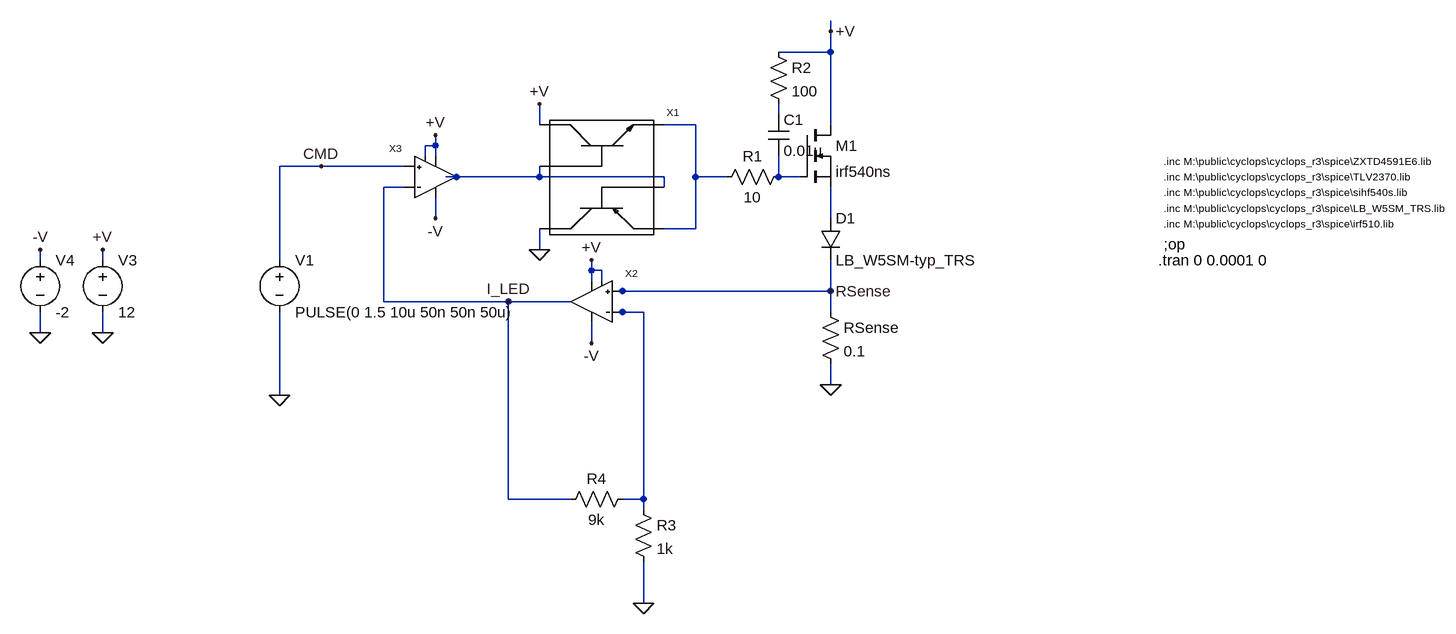
[diagram p0: schematic cyclops_r3.2.asc]
cyclops_r3.2.asc, the LTspice schematic file:
Version 4
SHEET 1 1460 852
WIRE 160 -48 160 -64
WIRE 160 -16 160 -48
WIRE 160 -16 80 -16
WIRE 80 80 80 64
WIRE -288 96 -288 64
WIRE -48 96 -96 96
WIRE 160 96 160 -16
WIRE -448 128 -448 112
WIRE -448 128 -464 128
WIRE -464 144 -464 128
WIRE -448 144 -448 128
WIRE -624 160 -688 160
WIRE -496 160 -624 160
WIRE -416 176 -432 176
WIRE -288 176 -288 160
WIRE -288 176 -416 176
WIRE -96 176 -288 176
WIRE -48 176 -48 96
WIRE 0 176 -48 176
WIRE 80 176 80 144
WIRE 112 176 80 176
WIRE -496 192 -528 192
WIRE -96 192 -96 176
WIRE -448 240 -448 208
WIRE 160 240 160 192
WIRE -48 256 -48 176
WIRE -48 256 -96 256
WIRE -288 288 -288 256
WIRE -1056 304 -1056 288
WIRE -960 304 -960 288
WIRE -688 304 -688 160
WIRE -208 320 -208 304
WIRE -192 320 -208 320
WIRE -208 336 -208 320
WIRE -192 336 -192 320
WIRE -160 352 -176 352
WIRE 160 352 160 304
WIRE 160 352 -160 352
WIRE -528 368 -528 192
WIRE -336 368 -528 368
WIRE -240 368 -336 368
WIRE -160 384 -176 384
WIRE -128 384 -160 384
WIRE 160 384 160 352
WIRE -1056 416 -1056 384
WIRE -960 416 -960 384
WIRE -208 432 -208 400
WIRE 160 496 160 464
WIRE -688 512 -688 384
WIRE -336 672 -336 368
WIRE -240 672 -336 672
WIRE -128 672 -128 384
WIRE -128 672 -160 672
WIRE -128 688 -128 672
WIRE -128 832 -128 768
FLAG 160 496 0
FLAG -128 832 0
FLAG -688 512 0
FLAG 160 352 RSense
FLAG -336 368 I_LED
FLAG -624 160 CMD
FLAG -960 416 0
FLAG -960 288 +V
FLAG -1056 416 0
FLAG -1056 288 -V
FLAG 160 -48 +V
FLAG -288 64 +V
FLAG -288 288 0
FLAG -448 240 -V
FLAG -208 432 -V
FLAG -448 112 +V
FLAG -208 304 +V
SYMBOL nmos 112 96 R0
SYMATTR InstName M1
SYMATTR Value irf540ns
SYMATTR Prefix X
SYMBOL res 144 368 R0
SYMATTR InstName RSense
SYMATTR Value 0.1
SYMATTR SpiceLine pwr=1
SYMBOL res -144 672 R0
SYMATTR InstName R3
SYMATTR Value 1k
SYMBOL res -144 656 R90
WINDOW 0 0 56 VBottom 2
WINDOW 3 32 56 VTop 2
SYMATTR InstName R4
SYMATTR Value 9k
SYMBOL voltage -688 288 R0
WINDOW 123 0 0 Left 2
WINDOW 39 0 0 Left 2
SYMATTR InstName V1
SYMATTR Value PULSE(0 1.5 10u 50n 50n 50u)
SYMBOL voltage -960 288 R0
WINDOW 123 0 0 Left 2
WINDOW 39 0 0 Left 2
SYMATTR InstName V3
SYMATTR Value 12
SYMBOL voltage -1056 288 R0
WINDOW 123 0 0 Left 2
WINDOW 39 0 0 Left 2
SYMATTR InstName V4
SYMATTR Value -2
SYMBOL diode 144 240 R0
SYMATTR InstName D1
SYMATTR Value LB_W5SM-typ_TRS
SYMBOL ZXTD45 -192 176 R0
SYMATTR InstName X1
SYMATTR Prefix X
SYMATTR Value ZXTD4591E6
SYMBOL res 96 160 R90
WINDOW 0 0 56 VBottom 2
WINDOW 3 32 56 VTop 2
SYMATTR InstName R1
SYMATTR Value 10
SYMBOL res 64 -32 R0
SYMATTR InstName R2
SYMATTR Value 100
SYMBOL cap 64 80 R0
SYMATTR InstName C1
SYMATTR Value 0.01µ
SYMATTR SpiceLine V=50
SYMBOL TLV2370 -224 368 R0
SYMATTR InstName X2
SYMATTR Prefix X
SYMATTR Value TLV2370
SYMBOL TLV2370 -432 176 M0
SYMATTR InstName X3
SYMATTR Prefix X
SYMATTR Value TLV2370
TEXT 672 200 Left 1 !.inc M:\\public\\cyclops\\cyclops_r3\\spice\\sihf540s.lib
TEXT 672 280 Left 2 !;op
TEXT 672 224 Left 1 !.inc M:\\public\\cyclops\\cyclops_r3\\spice\\LB_W5SM_TRS.lib
TEXT 664 304 Left 2 !.tran 0 0.0001 0
TEXT 672 176 Left 1 !.inc M:\\public\\cyclops\\cyclops_r3\\spice\\TLV2370.lib
TEXT 672 152 Left 1 !.inc M:\\public\\cyclops\\cyclops_r3\\spice\\ZXTD4591E6.lib
TEXT 672 248 Left 1 !.inc M:\\public\\cyclops\\cyclops_r3\\spice\\irf510.lib

The netlist it stands for:
* cyclops_r3.2.asc
XM1 +V N004 N005 irf540ns  ; pins D G S
RSense RSense 0 0.1 pwr=1
R3 N006 0 1k
R4 N006 I_LED 9k
V1 CMD 0 PULSE(0 1.5 10u 50n 50n 50u)
V3 +V 0 12
V4 -V 0 -2
D1 N005 RSense LB_W5SM-typ_TRS
XX1 +V N003 0 N002 N003 N002 ZXTD45 params: ZXTD4591E6  ; pins C1 B1 C2 E2 B2 E1
R1 N004 N002 10
R2 +V N001 100
C1 N001 N004 0.01µ V=50
XX2 RSense N006 +V -V I_LED +V TLV2370 params: TLV2370  ; pins 3 4 6 2 1 5
XX3 CMD I_LED +V -V N003 +V TLV2370 params: TLV2370  ; pins 3 4 6 2 1 5
.model D D
.lib standard.dio
.inc M:\public\cyclops\cyclops_r3\spice\sihf540s.lib
;op
.inc M:\public\cyclops\cyclops_r3\spice\LB_W5SM_TRS.lib
.tran 0 0.0001 0
.inc M:\public\cyclops\cyclops_r3\spice\TLV2370.lib
.inc M:\public\cyclops\cyclops_r3\spice\ZXTD4591E6.lib
.inc M:\public\cyclops\cyclops_r3\spice\irf510.lib
.backanno
.end